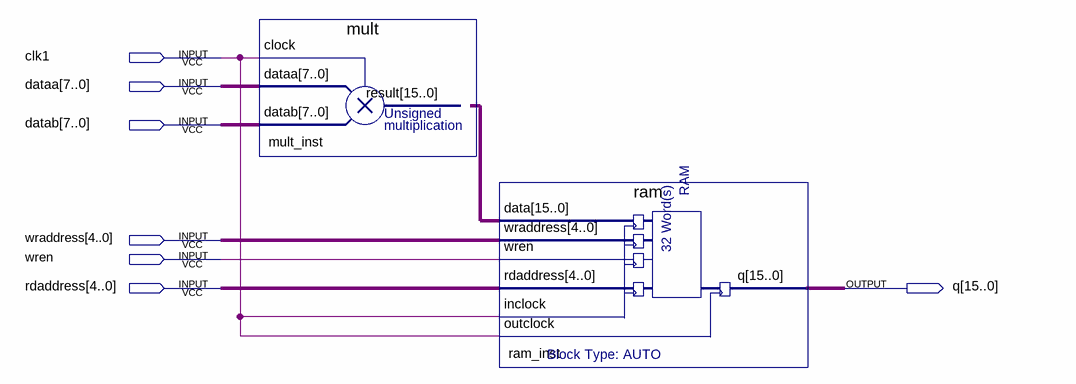
[diagram p0: schematic sheet]
// Quartus schematic pipemult2.bdf as structural Verilog: 2 symbols, 7 pins
module pipemult2 (
  input  clk1,
  input  [7:0] dataa,
  input  [7:0] datab,
  input  [4:0] wraddress,
  input  wren,
  input  [4:0] rdaddress,
  output [15:0] q
);

  wire [15:0] mult_inst_result;

  mult mult_inst (.clock(clk1), .dataa(dataa), .datab(datab), .result(mult_inst_result));
  ram ram_inst (
    .data(mult_inst_result), .wraddress(wraddress), .wren(wren), .rdaddress(rdaddress), .inclock(clk1),
    .outclock(clk1), .q(q));
endmodule
